# Altium project F1C100S.PrjPcb
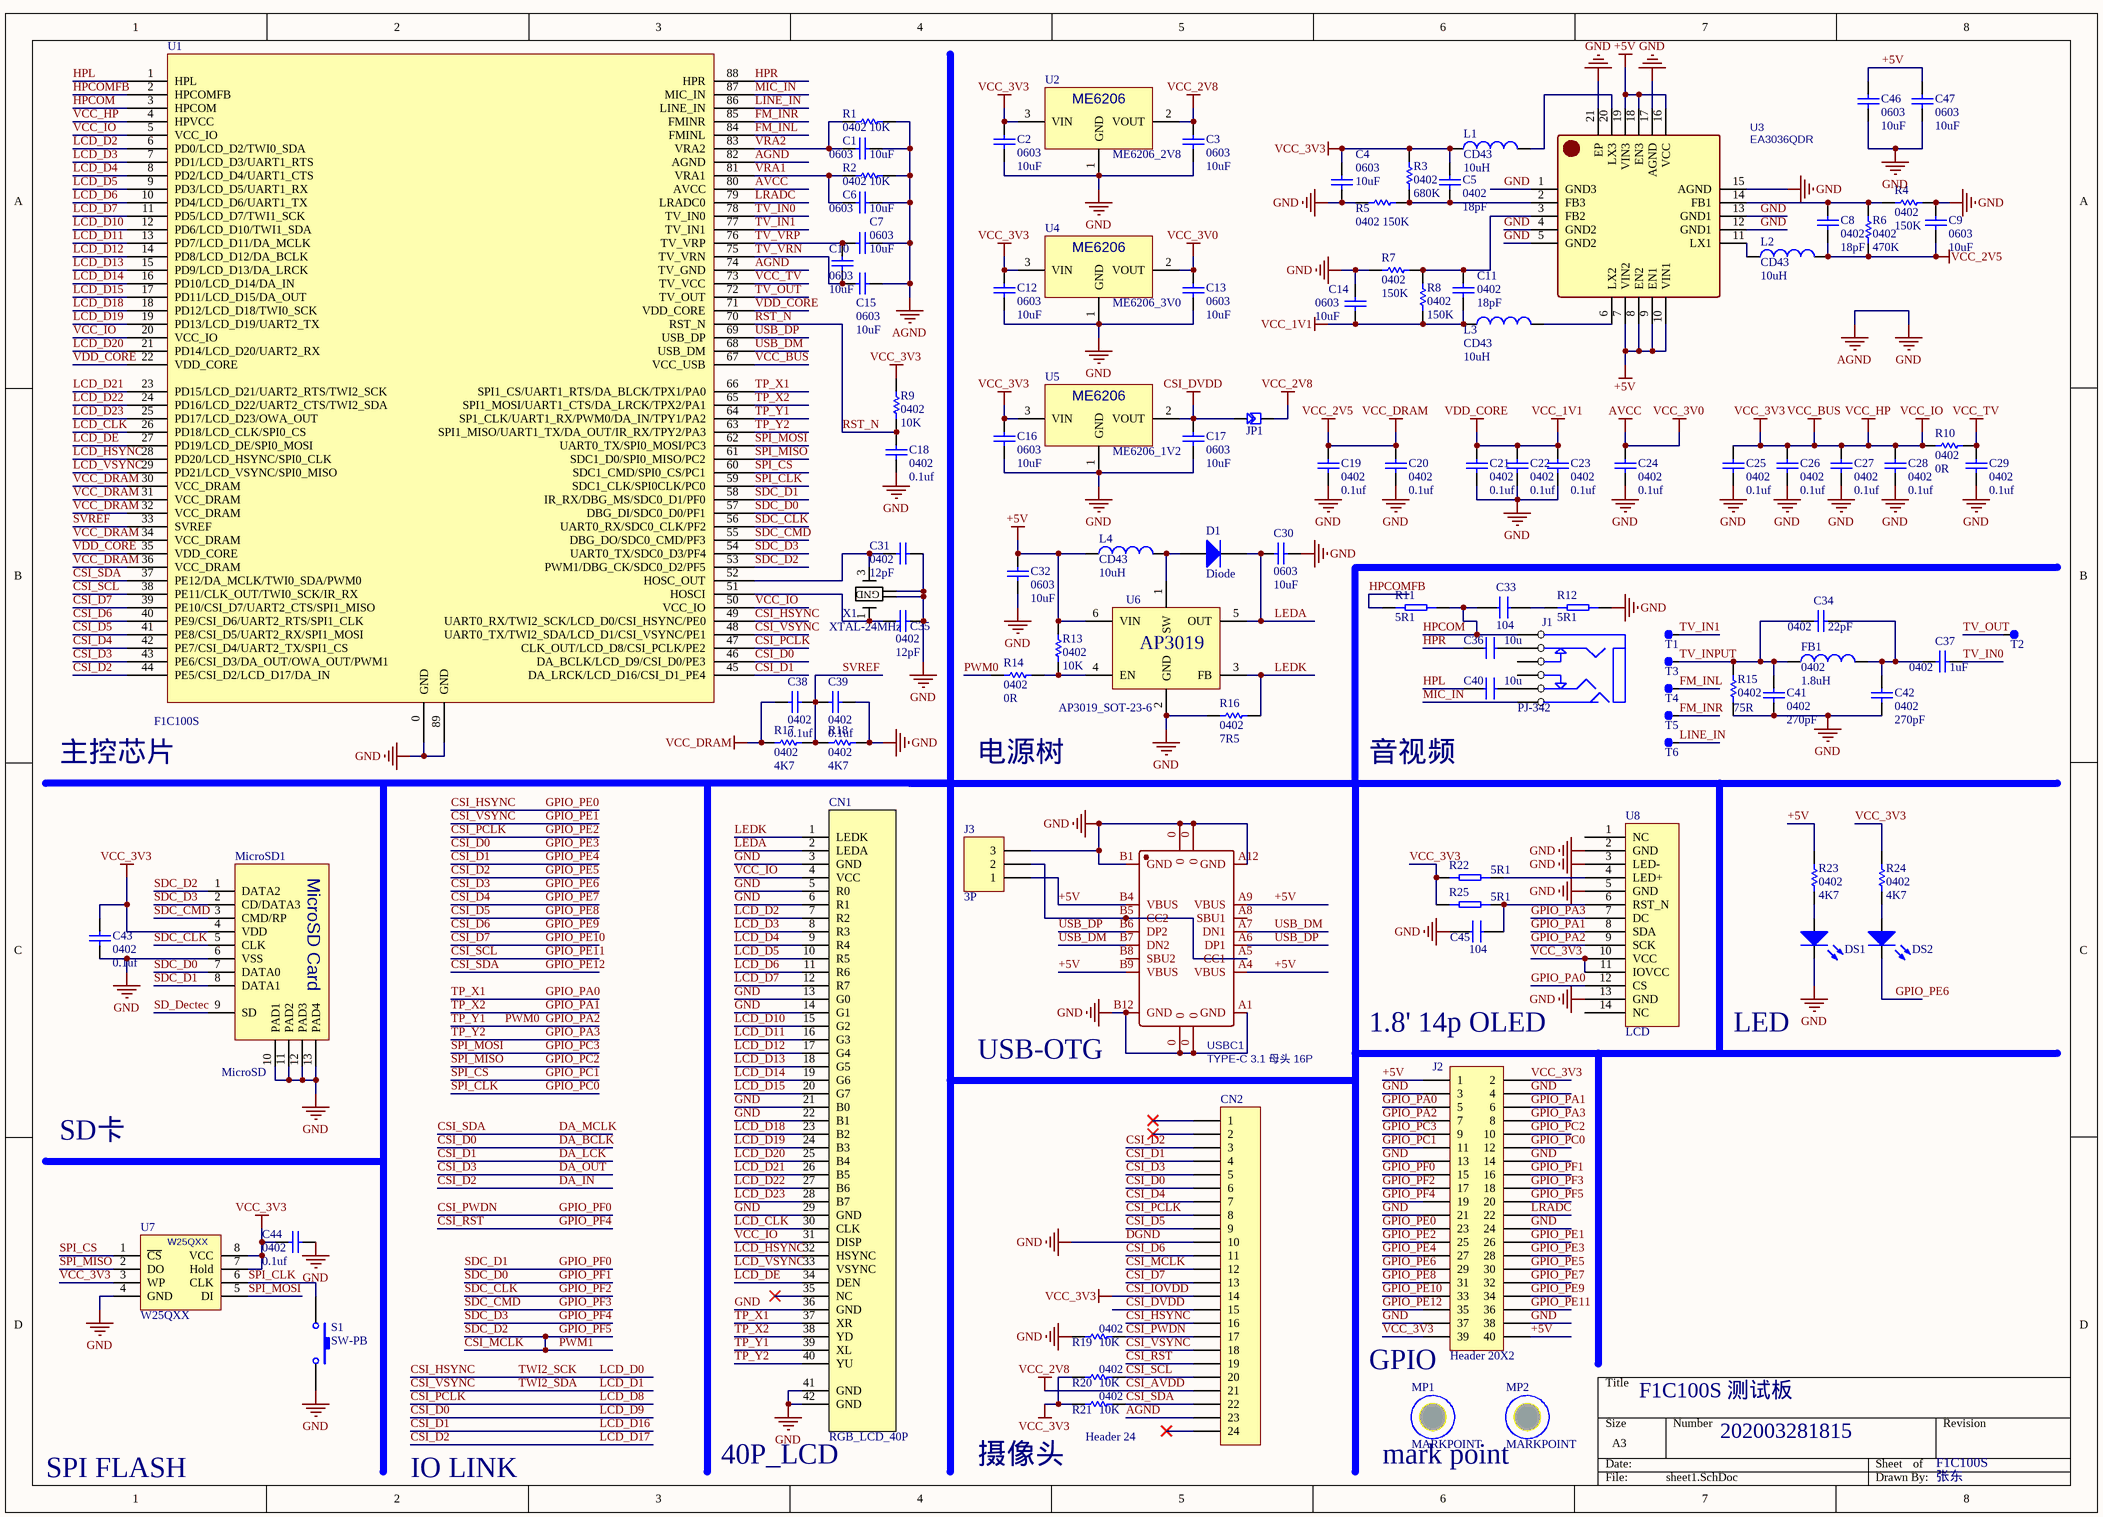
[diagram p0: sheet1.SchDoc]
1 sheet, 106 parts. Net scope: global (net labels, ports and power ports of the same name join across sheets).
Board file: PCB1.PcbDoc

## Sheet sheet1.SchDoc
size A3

### Parts
C1  0603  value 10uF  [0603AC]
C2  0603  value 10uF  [0603AC]
C3  0603  value 10uF  [0603AC]
C4  0603  value 10uF  [0603AC]
C5  0402  value 18pF  [0402AC]
C6  0603  value 10uF  [0603AC]
C7  0603  value 10uF  [0603AC]
C8  0402  value 18pF  [0402AC]
C9  0603  value 10uF  [0603AC]
C10  0603  value 10uF  [0603AC]
C11  0402  value 18pF  [0402AC]
C12  0603  value 10uF  [0603AC]
C13  0603  value 10uF  [0603AC]
C14  0603  value 10uF  [0603AC]
C15  0603  value 10uF  [0603AC]
C16  0603  value 10uF  [0603AC]
C17  0603  value 10uF  [0603AC]
C18  0402  value 0.1uf  [0402AC]
C19  0402  value 0.1uf  [0402AC]
C20  0402  value 0.1uf  [0402AC]
C21  0402  value 0.1uf  [0402AC]
C22  0402  value 0.1uf  [0402AC]
C23  0402  value 0.1uf  [0402AC]
C24  0402  value 0.1uf  [0402AC]
C25  0402  value 0.1uf  [0402AC]
C26  0402  value 0.1uf  [0402AC]
C27  0402  value 0.1uf  [0402AC]
C28  0402  value 0.1uf  [0402AC]
C29  0402  value 0.1uf  [0402AC]
C30  0603  value 10uF  [0603AC]
C31  0402  value 12pF  [0402AC]
C32  0603  value 10uF  [0603AC]
C33  104  [0402C]
C34  0402  value 22pF  [0402AC]
C35  0402  value 12pF  [0402AC]
C36  10u  [0402C]
C37  0402  value 1uF  [0402AC]
C38  0402  value 0.1uf  [0402AC]
C39  0402  value 0.1uf  [0402AC]
C40  10u  [0402C]
C41  0402  value 270pF  [0402AC]
C42  0402  value 270pF  [0402AC]
C43  0402  value 0.1uf  [0402AC]
C44  0402  value 0.1uf  [0402AC]
C45  104  [0402C]
C46  0603  value 10uF  [0603AC]
C47  0603  value 10uF  [0603AC]
CN1  RGB_LCD_40P  [FH19C-40S-0.5SH]
CN2  Header 24  [FH19C-24S-0.5SH]
D1  Diode  [SOD123]
DS1  LED  [LED 0805B]  (value not drawn)
DS2  LED  [LED 0805B]  (value not drawn)
FB1  0402  value 1.8uH  [0402AR]
J1  PJ-342  [PJ-342]
J2  Header 20X2  [HDR2X20]
J3  3P  [3P]
JP1  SW-PAD-2  [SW-PAD-2]  (value not drawn)
L1  CD43  value 10uH  [2520]
L2  CD43  value 10uH  [2520]
L3  CD43  value 10uH  [2520]
L4  CD43  value 10uH  [2520]
MicroSD1  MicroSD  [MicroSD]
MP1  MARKPOINT  [MARKPOINT]
MP2  MARKPOINT  [MARKPOINT]
R1  0402  value 10K  [0402AR]
R2  0402  value 10K  [0402AR]
R3  0402  value 680K  [0402AR]
R4  0402  value 150K  [0402AR]
R5  0402  value 150K  [0402AR]
R6  0402  value 470K  [0402AR]
R7  0402  value 150K  [0402AR]
R8  0402  value 150K  [0402AR]
R9  0402  value 10K  [0402AR]
R10  0402  value 0R  [0402AR]
R11  5R1  [0402R]
R12  5R1  [0402R]
R13  0402  value 10K  [0402AR]
R14  0402  value 0R  [0402AR]
R15  0402  value 75R  [0402AR]
R16  0402  value 7R5  [0402AR]
R17  0402  value 4K7  [0402AR]
R18  0402  value 4K7  [0402AR]
R19  0402  value 10K  [0402AR]
R20  0402  value 10K  [0402AR]
R21  0402  value 10K  [0402AR]
R22  5R1  [0402R]
R23  0402  value 4K7  [0402AR]
R24  0402  value 4K7  [0402AR]
R25  5R1  [0402R]
S1  SW-PB  [SW-SMD1]
T1  1 测试点  [SIP1-1*1]  (value not drawn)
T2  1 测试点  [SIP1-1*1]  (value not drawn)
T3  1 测试点  [SIP1-1*1]  (value not drawn)
T4  1 测试点  [SIP1-1*1]  (value not drawn)
T5  1 测试点  [SIP1-1*1]  (value not drawn)
T6  1 测试点  [SIP1-1*1]  (value not drawn)
U1  F1C100S  [QFN88-10X10]
U2  ME6206_2V8  [SOT-23]
U3  EA3036QDR  [QFN20-3x3-0.4]
U4  ME6206_3V0  [SOT-23]
U5  ME6206_1V2  [SOT-23]
U6  AP3019_SOT-23-6  [SOT23-6]
U7  W25QXX  [SO-8M]
U8  LCD  [LCD_SPI_14P_sim]
USBC1  TYPE-C 3.1 母头 16P  [TYPE-C-USB-12]
X1  XTAL-24MHz  [XTAL-3225]

### Nets
+5V: C32.2 C46.2 C47.2 J2.1 J2.40 J3.1 L4.1 R13.1 R23.2 U3.7(VIN2) U3.8(EN2) U3.9(EN1) U3.10(VIN1) U3.16(VCC) U3.18(EN3) U3.19(VIN3) U6.6(VIN) USBC1.A4(VBUS) USBC1.A9(VBUS) USBC1.B4(VBUS) USBC1.B9(VBUS)
AGND: C1.2 C2.1 C3.1 C4.2 C6.2 C7.2 C9.2 C12.1 C13.1 C14.1 C15.2 C16.1 C17.1 C18.1 C19.1 C20.1 C21.1 C22.1 C23.1 C24.1 C25.2 C26.1 C27.1 C28.1 C29.1 C30.2 C31.1 C32.1 C35.1 C39.1 C41.2 C42.2 C43.1 C44.1 C45.2 C46.1 C47.1 CN1.3(GND) CN1.5(R0) CN1.6(R1) CN1.13(G0) CN1.14(G1) CN1.21(B0) CN1.22(B1) CN1.29(GND) CN1.36(GND) CN1.41(GND) CN1.42(GND) CN2.10 CN2.23 DS1.2(K) J2.3 J2.4 J2.13 J2.14 J2.21 J2.24 J2.37 J2.38 J3.3 MicroSD1.6(VSS) MicroSD1.10(PAD1) MicroSD1.11(PAD2) MicroSD1.12(PAD3) MicroSD1.13(PAD4) R1.1 R2.1 R4.2 R5.2 R7.2 R12.2 R15.1 R16.1 R18.1 R19.1 S1.2 U1.0(GND) U1.74(TV_GND) U1.82(AGND) U1.89(GND) U2.1(GND) U3.1(GND3) U3.4(GND2) U3.5(GND2) U3.12(GND1) U3.13(GND1) U3.15(AGND) U3.17(AGND) U3.21(EP) U4.1(GND) U5.1(GND) U6.2(GND) U7.4(GND) U8.2(GND) U8.3(LED-) U8.5(GND) U8.13(GND) USBC1.0 USBC1.A1(GND) USBC1.A12(GND) USBC1.B1(GND) USBC1.B12(GND) X1.2 X1.4  [also labelled DGND, GND]
AVCC: C13.2 C24.2 U1.80(AVCC) U4.2(VOUT)  [also labelled VCC_3V0]
CSI_AVDD: C3.2 CN2.21 JP1.2 U2.2(VOUT)  [also labelled VCC_2V8]
CSI_DVDD: C17.2 CN2.15 JP1.1 U5.2(VOUT)
CSI_IOVDD: C2.2 C4.1 C5.1 C12.2 C16.2 C25.1 C26.2 C27.2 C28.2 C43.2 C44.2 CN1.4(VCC) CN1.31(DISP) CN2.14 J2.2 J2.39 L1.1 MicroSD1.4(VDD) R3.2 R9.2 R10.2 R20.2 R21.2 R22.1 R24.2 R25.1 U1.4(HPVCC) U1.5(VCC_IO) U1.20(VCC_IO) U1.50(VCC_IO) U1.67(VCC_USB) U2.3(VIN) U4.3(VIN) U5.3(VIN) U7.3(WP) U7.7(Hold) U7.8(VCC) U8.10(VCC) U8.11(IOVCC)  [also labelled VCC_3V3, VCC_BUS, VCC_HP, VCC_IO]
VCC_DRAM: C8.1 C9.1 C19.2 C20.2 C38.2 L2.2 R6.2 R17.2 U1.30(VCC_DRAM) U1.31(VCC_DRAM) U1.32(VCC_DRAM) U1.34(VCC_DRAM) U1.36(VCC_DRAM)  [also labelled VCC_2V5]
VCC_TV: C29.2 R10.1 U1.73(TV_VCC)
VDD_CORE: C11.1 C14.2 C21.2 C22.2 C23.2 L3.1 R8.1 U1.22(VDD_CORE) U1.35(VDD_CORE) U1.71(VDD_CORE)  [also labelled VCC_1V1]
CSI_D0: CN2.6 J2.28 U1.46(DA_BCLK/LCD_D9/CSI_D0/PE3)  [also labelled DA_BCLK, GPIO_PE3, LCD_D9]
CSI_D1: CN2.4 J2.27 U1.45(DA_LRCK/LCD_D16/CSI_D1_PE4)  [also labelled DA_LCK, GPIO_PE4, LCD_D16]
CSI_D2: CN2.3 J2.30 U1.44(PE5/CSI_D2/LCD_D17/DA_IN)  [also labelled DA_IN, GPIO_PE5, LCD_D17]
CSI_D3: CN2.5 DS2.2(K) J2.29 U1.43(PE6/CSI_D3/DA_OUT/OWA_OUT/PWM1)  [also labelled DA_OUT, GPIO_PE6]
CSI_D4: CN2.7 J2.32 U1.42(PE7/CSI_D4/UART2_TX/SPI1_CS)  [also labelled GPIO_PE7]
CSI_D5: CN2.9 J2.31 U1.41(PE8/CSI_D5/UART2_RX/SPI1_MOSI)  [also labelled GPIO_PE8]
CSI_D6: CN2.11 J2.34 U1.40(PE9/CSI_D6/UART2_RTS/SPI1_CLK)  [also labelled GPIO_PE9]
CSI_D7: CN2.13 J2.33 U1.39(PE10/CSI_D7/UART2_CTS/SPI1_MISO)  [also labelled GPIO_PE10]
CSI_HSYNC: CN2.16 J2.23 U1.49(UART0_RX/TWI2_SCK/LCD_D0/CSI_HSYNC/PE0)  [also labelled GPIO_PE0, LCD_D0, TWI2_SCK]
CSI_MCLK: CN2.12 J2.20 MicroSD1.1(DATA2) U1.53(PWM1/DBG_CK/SDC0_D2/PF5)  [also labelled GPIO_PF5, PWM1, SDC_D2]
CSI_PCLK: CN2.8 J2.25 U1.47(CLK_OUT/LCD_D8/CSI_PCLK/PE2)  [also labelled GPIO_PE2, LCD_D8]
CSI_PWDN: CN2.17 J2.15 MicroSD1.8(DATA1) R19.2 U1.58(IR_RX/DBG_MS/SDC0_D1/PF0)  [also labelled GPIO_PF0, SDC_D1]
CSI_RST: CN2.19 J2.19 MicroSD1.2(CD/DATA3) U1.54(UART0_TX/SDC0_D3/PF4)  [also labelled GPIO_PF4, SDC_D3]
CSI_SCL: CN2.20 J2.36 R20.1 U1.38(PE11/CLK_OUT/TWI0_SCK/IR_RX)  [also labelled GPIO_PE11]
CSI_SDA: CN2.22 J2.35 R21.1 U1.37(PE12/DA_MCLK/TWI0_SDA/PWM0)  [also labelled DA_MCLK, GPIO_PE12]
CSI_VSYNC: CN2.18 J2.26 U1.48(UART0_TX/TWI2_SDA/LCD_D1/CSI_VSYNC/PE1)  [also labelled GPIO_PE1, LCD_D1, TWI2_SDA]
FM_INL: T4.1 U1.84(FMINL)
FM_INR: T5.1 U1.85(FMINR)
GPIO_PA0: CN1.37(XR) J2.5 U1.66(SPI1_CS/UART1_RTS/DA_BLCK/TPX1/PA0) U8.12(CS)  [also labelled TP_X1]
GPIO_PA1: CN1.38(YD) J2.6 U1.65(SPI1_MOSI/UART1_CTS/DA_LRCK/TPX2/PA1) U8.8(SDA)  [also labelled TP_X2]
GPIO_PA2: CN1.39(XL) J2.7 R14.1 U1.64(SP1_CLK/UART1_RX/PWM0/DA_IN/TPY1/PA2) U8.9(SCK)  [also labelled PWM0, TP_Y1]
GPIO_PA3: CN1.40(YU) J2.8 U1.63(SPI1_MISO/UART1_TX/DA_OUT/IR_RX/TPY2/PA3) U8.7(DC)  [also labelled TP_Y2]
GPIO_PC0: J2.12 S1.1 U1.59(SDC1_CLK/SPI0CLK/PC0) U7.6(CLK)  [also labelled SPI_CLK]
GPIO_PC1: J2.11 U1.60(SDC1_CMD/SPI0_CS/PC1) U7.1(~{CS})  [also labelled SPI_CS]
GPIO_PC2: J2.10 U1.61(SDC1_D0/SPI0_MISO/PC2) U7.2(DO)  [also labelled SPI_MISO]
GPIO_PC3: J2.9 U1.62(UART0_TX/SPI0_MOSI/PC3) U7.5(DI)  [also labelled SPI_MOSI]
GPIO_PF1: J2.16 MicroSD1.7(DATA0) U1.57(DBG_DI/SDC0_D0/PF1)  [also labelled SDC_D0]
GPIO_PF2: J2.17 MicroSD1.5(CLK) U1.56(UART0_RX/SDC0_CLK/PF2)  [also labelled SDC_CLK]
GPIO_PF3: J2.18 MicroSD1.3(CMD/RP) U1.55(DBG_DO/SDC0_CMD/PF3)  [also labelled SDC_CMD]
HPCOM: C33.1 J1.2(MIC) R11.2 U1.3(HPCOM)
HPCOMFB: R11.1 U1.2(HPCOMFB)
HPL: C40.2 U1.1(HPL)
HPR: C36.1 U1.88(HPR)
LCD_CLK: CN1.30(CLK) U1.26(PD18/LCD_CLK/SPI0_CS)
LCD_D2: CN1.7(R2) U1.6(PD0/LCD_D2/TWI0_SDA)
LCD_D3: CN1.8(R3) U1.7(PD1/LCD_D3/UART1_RTS)
LCD_D4: CN1.9(R4) U1.8(PD2/LCD_D4/UART1_CTS)
LCD_D5: CN1.10(R5) U1.9(PD3/LCD_D5/UART1_RX)
LCD_D6: CN1.11(R6) U1.10(PD4/LCD_D6/UART1_TX)
LCD_D7: CN1.12(R7) U1.11(PD5/LCD_D7/TWI1_SCK)
LCD_D10: CN1.15(G2) U1.12(PD6/LCD_D10/TWI1_SDA)
LCD_D11: CN1.16(G3) U1.13(PD7/LCD_D11/DA_MCLK)
LCD_D12: CN1.17(G4) U1.14(PD8/LCD_D12/DA_BCLK)
LCD_D13: CN1.18(G5) U1.15(PD9/LCD_D13/DA_LRCK)
LCD_D14: CN1.19(G6) U1.16(PD10/LCD_D14/DA_IN)
LCD_D15: CN1.20(G7) U1.17(PD11/LCD_D15/DA_OUT)
LCD_D18: CN1.23(B2) U1.18(PD12/LCD_D18/TWI0_SCK)
LCD_D19: CN1.24(B3) U1.19(PD13/LCD_D19/UART2_TX)
LCD_D20: CN1.25(B4) U1.21(PD14/LCD_D20/UART2_RX)
LCD_D21: CN1.26(B5) U1.23(PD15/LCD_D21/UART2_RTS/TWI2_SCK)
LCD_D22: CN1.27(B6) U1.24(PD16/LCD_D22/UART2_CTS/TWI2_SDA)
LCD_D23: CN1.28(B7) U1.25(PD17/LCD_D23/OWA_OUT)
LCD_DE: CN1.34(DEN) U1.27(PD19/LCD_DE/SPI0_MOSI)
LCD_HSYNC: CN1.32(HSYNC) U1.28(PD20/LCD_HSYNC/SPI0_CLK)
LCD_VSYNC: CN1.33(VSYNC) U1.29(PD21/LCD_VSYNC/SPI0_MISO)
LEDA: C30.1 CN1.2(LEDA) D1.2(K) U6.5(OUT)
LEDK: CN1.1(LEDK) R16.2 U6.3(FB)
LINE_IN: T6.1 U1.86(LINE_IN)
LRADC: J2.22 U1.79(LRADC0)
MIC_IN: J1.3(GND) U1.87(MIC_IN)
RST_N: C18.2 R9.1 U1.70(RST_N)
SD_Dectec: MicroSD1.9(SD)
SVREF: C38.1 C39.2 R17.1 R18.2 U1.33(SVREF)
TV_IN0: C37.1 U1.78(TV_IN0)
TV_IN1: T1.1 U1.77(TV_IN1)
TV_INPUT: C34.2 C41.1 FB1.1 R15.2 T3.1
TV_OUT: T2.1 U1.72(TV_OUT)
TV_VRN: C10.1 C15.1 U1.75(TV_VRN)
TV_VRP: C7.1 C10.2 U1.76(TV_VRP)
USB_DM: U1.68(USB_DM) USBC1.A7(DN1) USBC1.B7(DN2)
USB_DP: U1.69(USB_DP) USBC1.A6(DP1) USBC1.B6(DP2)
VRA1: C6.1 R2.2 U1.81(VRA1)
VRA2: C1.1 R1.2 U1.83(VRA2)
NetC5_2: C5.2 R3.1 R5.1 U3.2(FB3)
NetC8_2: C8.2 R4.1 R6.1 U3.14(FB1)
NetC11_2: C11.2 R7.1 R8.2 U3.3(FB2)
NetC31_2: C31.2 U1.52(HOSC_OUT) X1.3(GND)
NetC33_2: C33.2 R12.1
NetC34_1: C34.1 C37.2 C42.1 FB1.2
NetC35_2: C35.2 U1.51(HOSCI) X1.1
NetC36_2: C36.2 J1.4(R)
NetC40_1: C40.1 J1.6(L)
NetC45_1: C45.1 R25.2 U8.6(RST_N)
NetD1_1: D1.1(A) L4.2 U6.1(SW)
NetDS1_1: DS1.1(A) R23.1
NetDS2_1: DS2.1(A) R24.1
NetJ3_2: J3.2 USBC1.A5(CC1) USBC1.B5(CC2)
NetL1_2: L1.2 U3.20(LX3)
NetL2_1: L2.1 U3.11(LX1)
NetL3_2: L3.2 U3.6(LX2)
NetR13_2: R13.2 R14.2 U6.4(EN)
NetR22_2: R22.2 U8.4(LED+)

Not connected (* = marked no-connect by the designer): CN1 35(NC)*; CN2 1* 2* 24*; J1 5(R_DET) 7(L_DET); U8 1(NC) 14(NC); USBC1 A8(SBU1) B8(SBU2)

### Notes on the sheet
- 主控芯片
- 电源树
- 音视频
- USB-OTG
- (near J2) 1.8' 14p OLED
- LED
- SD卡
- (near J2) GPIO
- F1C100S 测试板
- (near CN1) 40P_LCD
- 摄像头
- mark point
- 202003281815
- F1C100S
- SPI FLASH
- IO LINK
- 张东
- (in symbol MicroSD) MicroSD Card

### Library data of the parts
C1-C32 C34 C35 C37-C39 C41-C44 C46 C47 = Cap: Capacitor; Published: 8-Jun-2000; LatestRevisionDate: 17-Jul-2002; LatestRevisionNote: Re-released for DXP Platform.; PackageReference: RAD-0.3; Publisher: Altium Limited
C33 C36 C40 C45 = CAP: SMD-CAP
CN2 = Header 24: Header, 24-Pin; LatestRevisionDate: 17-Jul-2002; LatestRevisionNote: Re-released for DXP Platform.; Publisher: Altium Limited
D1 = Diode: Default Diode; Published: 8-Jun-2000; LatestRevisionDate: 17-Jul-2002; LatestRevisionNote: Re-released for DXP Platform.; PackageVersion: Sep-1996; PackageReference: SMC; Publisher: Altium Limited; Code_JEDEC: DO-214-AB
FB1 = Inductor: CD43; Code_IEC: 1005; Published: 8-Jun-2000; LatestRevisionDate: 29-May-2009; LatestRevisionNote: IPC-7351 Footprint Added.; PackageReference: 0402-A; Publisher: Altium Limited; PackageDescription: Chip Inductor; Code_JEITA: 0402
J2 = Header 20X2: Header, 20-Pin, Dual row; LatestRevisionDate: 17-Jul-2002; LatestRevisionNote: Re-released for DXP Platform.; Publisher: Altium Limited
L1-L4 = Inductor: Code_IEC: 1005; Published: 8-Jun-2000; LatestRevisionDate: 29-May-2009; LatestRevisionNote: IPC-7351 Footprint Added.; PackageReference: 0402-A; Publisher: Altium Limited; PackageDescription: Chip Inductor; Code_JEITA: 0402
R1 R2 R4 R5 R15 = Res1: Resistor; Published: 8-Jun-2000; LatestRevisionDate: 17-Jul-2002; LatestRevisionNote: Re-released for DXP Platform.; PackageReference: AXIAL-0.3; Publisher: Altium Limited
R3 R6-R10 R13 R14 R16-R21 R23 R24 = Res1: Published: 8-Jun-2000; LatestRevisionDate: 17-Jul-2002; LatestRevisionNote: Re-released for DXP Platform.; PackageReference: AXIAL-0.3; Publisher: Altium Limited
R11 R12 R22 R25 = R
S1 = SW-PB: Switch; Published: 24-Mar-1999; LatestRevisionDate: 17-Jul-2002; LatestRevisionNote: Re-released for DXP Platform.; PackageReference: SPST-2; Publisher: Altium Limited
U2 U4 U5 = ME6206
U3 = EA3036QDR: BOM_Manufacturer: Everanalog; spicePre: X; BOM_Manufacturer Part: EA3036QDR; BOM_Supplier: LCSC; BOM_Supplier Part: C111587
U6 = AP3019
U8 = LCD_SPI_14P
X1 = XTAL-SMD